# EAGLE schematic n64adv (EAGLE 9.5.1)

## Sheet 1 of 2
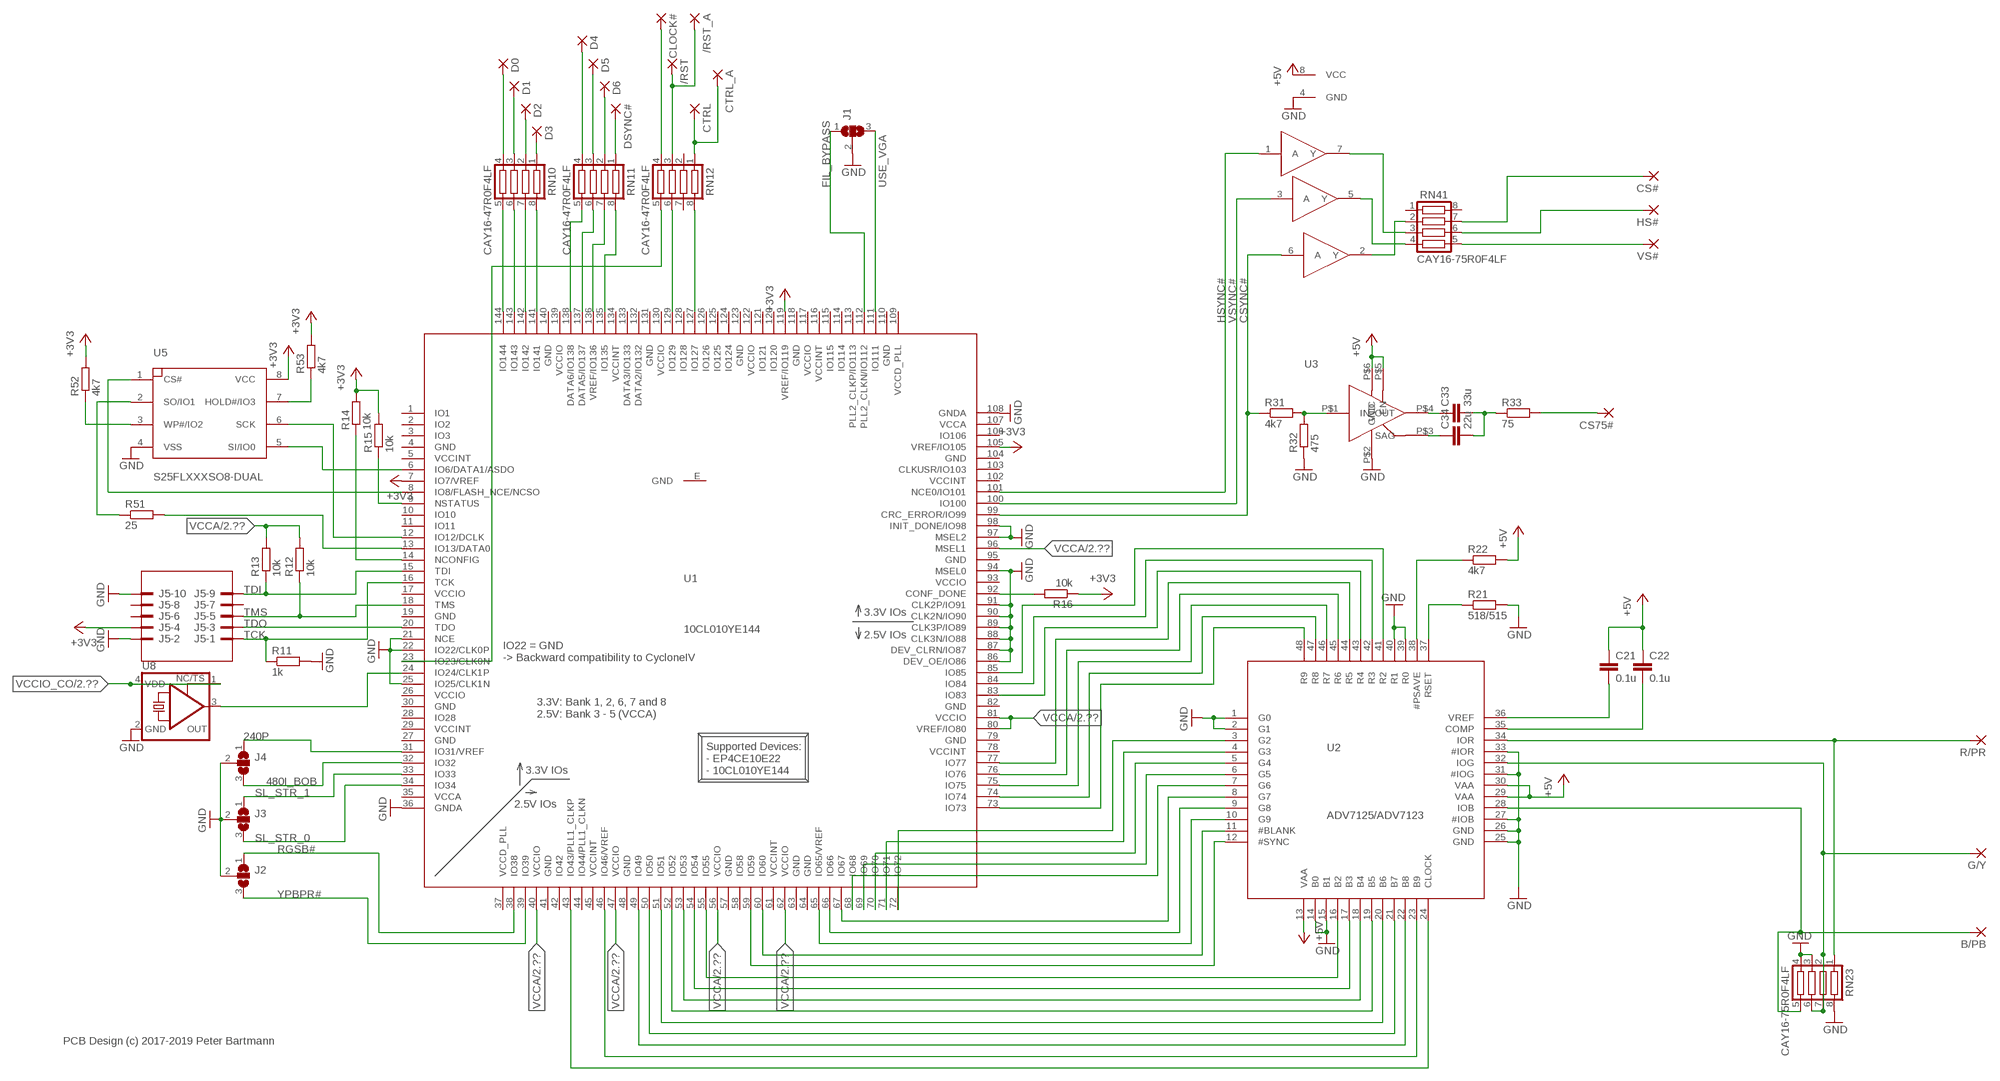
[diagram p0: schematic, sheet 1]

### Parts
/RST  SMD2  [SMD1,27-2,54]
/RST_A  SMD1  [SMD0,8-1,6]
B/PB  SMD2  [SMD1,27-2,54]
C21  0.1u  C-EUC0603  [C0603]
C22  0.1u  C-EUC0603  [C0603]
C33  33u  C-EUC1210  [C1210]
C34  22u  C-EUC1206  [C1206]
CLOCK#  SMD1  [SMD0,8-1,6]
CS75#  SMD2  [SMD1,27-2,54]
CS#  SMD2  [SMD1,27-2,54]
CTRL  SMD2  [SMD1,27-2,54]
CTRL_A  SMD1  [SMD0,8-1,6]
D0  SMD1  [SMD0,8-1,6]
D1  SMD1  [SMD0,8-1,6]
D2  SMD1  [SMD0,8-1,6]
D3  SMD1  [SMD0,8-1,6]
D4  SMD1  [SMD0,8-1,6]
D5  SMD1  [SMD0,8-1,6]
D6  SMD1  [SMD0,8-1,6]
DSYNC#  SMD1  [SMD0,8-1,6]
G/Y  SMD2  [SMD1,27-2,54]
HS#  SMD2  [SMD1,27-2,54]
J1  SJ2W  [SJ_2]
J2  SJ2W  [SJ_2]
J3  SJ2W  [SJ_2]
J4  SJ2W  [SJ_2]
J5  2510-  [PAK100/2500-10]
R11  1k  R-EU_R0603  [R0603]
R12  10k  R-EU_R0603  [R0603]
R13  10k  R-EU_R0603  [R0603]
R14  10k  R-EU_R0603  [R0603]
R15  10k  R-EU_R0603  [R0603]
R16  10k  R-EU_R0603  [R0603]
R21  518/515  R-EU_R0603  [R0603]
R22  4k7  R-EU_R0603  [R0603]
R31  4k7  R-EU_R0603  [R0603]
R32  475  R-EU_R0603  [R0603]
R33  75  R-EU_R0603  [R0603]
R51  25  R-EU_R0603  [R0603]
R52  4k7  R-EU_R0603  [R0603]
R53  4k7  R-EU_R0603  [R0603]
R/PR  SMD2  [SMD1,27-2,54]
RN10  CAY16-47R0F4LF  CTS742C083  [CTS742C083]
RN11  CAY16-47R0F4LF  CTS742C083  [CTS742C083]
RN12  CAY16-47R0F4LF  CTS742C083  [CTS742C083]
RN23  CAY16-75R0F4LF  CTS742C083  [CTS742C083]
RN41  CAY16-75R0F4LF  CTS742C083  [CTS742C083]
U1  10CL010YE144  [EQFP144_2]
U2  ADV7125/ADV7123  ADV7123  [LQFP48]
U3  TSH122ICT  [SC70]
U4  74LVC3G17  74LVC3G34  [74LVC3G34]
U5  S25FLXXXSO8-DUAL  [SO8-DUAL]
U8  KXO-PXO/XO-V96  [3.2X2.5_KXO-V96]
VS#  SMD2  [SMD1,27-2,54]

### Nets
240P: J4.1 U1.31(IO31/VREF)
480I_BOB: J4.3 U1.32(IO32)
+5V: C21.1 C22.1 R22.2 U2.13(VAA) U2.29(VAA) U2.30(VAA) U3.P$5(EN) U3.P$6(VCC) U4.8(VCC) ; also sheet 2
BLUE: B/PB.1(P) RN23.5 U2.28(IOB)
CSYNC47#: CS#.1(P) RN41.7
CSYNC#: R31.1 U1.99(CRC_ERROR/IO99) U4.6(A)
FIL_BYPASS: J1.1 U1.112(PLL2_CLKN/IO112)
GND: J1.2 J2.2 J3.2 J4.2 J5.2 J5.10 R11.2 R21.2 R32.1 RN23.3 RN23.4 RN23.8 U1.21(NCE) U1.22(IO22/CLK0P) U1.25(IO25/CLK1N) U1.36(GNDA) U1.86(DEV_OE/IO86) U1.87(DEV_CLRN/IO87) U1.88(CLK3N/IO88) U1.89(CLK3P/IO89) U1.90(CLK2N/IO90) U1.91(CLK2P/IO91) U1.94(MSEL0) U1.97(MSEL2) U1.98(INIT_DONE/IO98) U1.108(GNDA) U2.1(G0) U2.2(G1) U2.14(B0) U2.15(B1) U2.25(GND) U2.26(GND) U2.27(#IOB) U2.31(#IOG) U2.33(#IOR) U2.39(R0) U2.40(R1) U3.P$2(GND) U4.4(GND) U5.4(VSS) U8.2(GND) ; also sheet 2
GREEN: G/Y.1(P) RN23.2 RN23.6 RN23.7 U2.32(IOG)
HSYNC47#: HS#.1(P) RN41.6
HSYNC#: U1.101(NCE0/IO101) U4.1(A)
N$1: R31.2 R32.2 U3.P$1(IN)
N$2: R21.1 U2.37(RSET)
N$3: RN12.5 U1.23(IO23/CLK0N)
N$4: U1.43(IO43/PLL1_CLKP) U2.24(CLOCK)
N$5: U1.46(IO46/VREF) U2.23(B9)
N$6: U1.49(IO49) U2.22(B8)
N$7: U1.50(IO50) U2.21(B7)
N$8: R14.1 U1.14(NCONFIG)
N$9: U1.51(IO51) U2.20(B6)
N$10: U1.52(IO52) U2.19(B5)
N$11: U1.53(IO53) U2.18(B4)
N$12: U1.54(IO54) U2.17(B3)
N$13: U1.55(IO55) U2.16(B2)
N$14: U1.72(IO72) U2.3(G2)
N$15: C33.1 U3.P$4(OUT)
N$16: C34.1 U3.P$3(SAG)
N$17: C33.2 C34.2 R33.1
N$18: U1.71(IO71) U2.4(G3)
N$19: U1.70(IO70) U2.5(G4)
N$20: U1.69(IO69) U2.6(G5)
N$21: CS75#.1(P) R33.2
N$22: R22.1 U2.38(#PSAVE)
N$23: C22.2 U2.35(COMP)
N$24: C21.2 U2.36(VREF)
N$26: RN41.2 U4.2(Y)
N$27: U1.68(IO68) U2.7(G6)
N$28: U1.67(IO67) U2.8(G7)
N$29: U1.66(IO66) U2.9(G8)
N$30: U1.65(IO65/VREF) U2.10(G9)
N$31: U1.60(IO60) U2.11(#BLANK)
N$32: U1.59(IO59) U2.12(#SYNC)
N$33: U1.85(IO85) U2.41(R2)
N$34: U1.84(IO84) U2.42(R3)
N$35: U1.83(IO83) U2.43(R4)
N$36: U1.77(IO77) U2.44(R5)
N$37: U1.76(IO76) U2.45(R6)
N$38: U1.75(IO75) U2.46(R7)
N$39: U1.74(IO74) U2.47(R8)
N$40: U1.73(IO73) U2.48(R9)
N$41: RN10.5 U1.144(IO144)
N$42: RN10.6 U1.143(IO143)
N$43: RN10.7 U1.142(IO142)
N$44: RN10.8 U1.141(IO141)
N$45: R15.1 U1.9(NSTATUS)
N$46: RN11.5 U1.138(DATA6/IO138)
N$47: RN41.4 U4.5(Y)
N$49: RN11.6 U1.137(DATA5/IO137)
N$50: RN11.7 U1.136(VREF/IO136)
N$51: RN11.8 U1.135(IO135)
N$52: R16.2 U1.92(CONF_DONE)
N$53: D0.P$1(P) RN10.4
N$55: RN12.6 U1.129(IO129)
N$56: R53.1 U5.7(HOLD#/IO3)
N$57: RN12.8 U1.127(IO127)
N$58: D1.P$1(P) RN10.3
N$59: D2.P$1(P) RN10.2
N$60: D3.P$1(P) RN10.1
N$61: D4.P$1(P) RN11.4
N$62: D5.P$1(P) RN11.3
N$63: D6.P$1(P) RN11.2
N$64: DSYNC#.P$1(P) RN11.1
N$65: CLOCK#.P$1(P) RN12.4
N$66: CTRL.1(P) CTRL_A.P$1(P) RN12.1
N$67: R52.1 U5.3(WP#/IO2)
N$68: RN41.3 U4.7(Y)
N$69: R51.1 U5.2(SO/IO1)
N$70: /RST.1(P) /RST_A.P$1(P) RN12.3
N$72: R51.2 U1.13(IO13/DATA0)
N$73: U1.12(IO12/DCLK) U5.6(SCK)
N$75: U1.8(IO8/FLASH_NCE/NCSO) U5.1(CS#)
N$76: U1.6(IO6/DATA1/ASDO) U5.5(SI/IO0)
N$77: U1.24(IO24/CLK1P) U8.3(OUT)
RED: R/PR.1(P) RN23.1 U2.34(IOR)
RGSB#: J2.1 U1.38(IO38)
SL_STR_0: J3.3 U1.34(IO34)
SL_STR_1: J3.1 U1.33(IO33)
TCK: J5.1 R11.1 U1.16(TCK)
TDI: J5.9 R13.1 U1.15(TDI)
TDO: J5.3 U1.20(TDO)
TMS: J5.5 R12.1 U1.18(TMS)
USE_VGA: J1.3 U1.111(IO111)
VCCA: R12.2 R13.2 U1.40(VCCIO) U1.47(VCCIO) U1.56(VCCIO) U1.62(VCCIO) U1.80(VREF/IO80) U1.81(VCCIO) U1.96(MSEL1) ; also sheet 2
VCCIO: J5.4 R14.2 R15.2 R16.1 R52.2 R53.2 U1.7(IO7/VREF) U1.105(VREF/IO105) U1.119(VREF/IO119) U5.8(VCC) ; supply symbol labelled +3V3 ; also sheet 2
VCCIO_CO: U8.1(TS) U8.4(VDD) ; also sheet 2
VSYNC47#: RN41.5 VS#.1(P)
VSYNC#: U1.100(IO100) U4.3(A)
YPBPR#: J2.3 U1.39(IO39)
Unconnected: J5.6 J5.7 J5.8 RN12.2 RN12.7 RN41.1 RN41.8 U1.1(IO1) U1.2(IO2) U1.3(IO3) U1.10(IO10) U1.11(IO11) U1.28(IO28) U1.42(IO42) U1.44(IO44/PLL1_CLKN) U1.58(IO58) U1.103(CLKUSR/IO103) U1.106(IO106) U1.113(PLL2_CLKP/IO113) U1.114(IO114) U1.115(IO115) U1.120(IO120) U1.121(IO121) U1.124(IO124) U1.125(IO125) U1.126(IO126) U1.128(IO128) U1.132(DATA2/IO132) U1.133(DATA3/IO133)

### Notes on the sheet
- 3.3V IOs
- 2.5V IOs
- IO22 = GND
  -> Backward compatibility to CycloneIV
- 3.3V: Bank 1, 2, 6, 7 and 8
  2.5V: Bank 3 - 5 (VCCA)
- 3.3V IOs
- Supported Devices:
  - EP4CE10E22
  - 10CL010YE144
- 2.5V IOs
- PCB Design (c) 2017-2019 Peter Bartmann

## Sheet 2 of 2
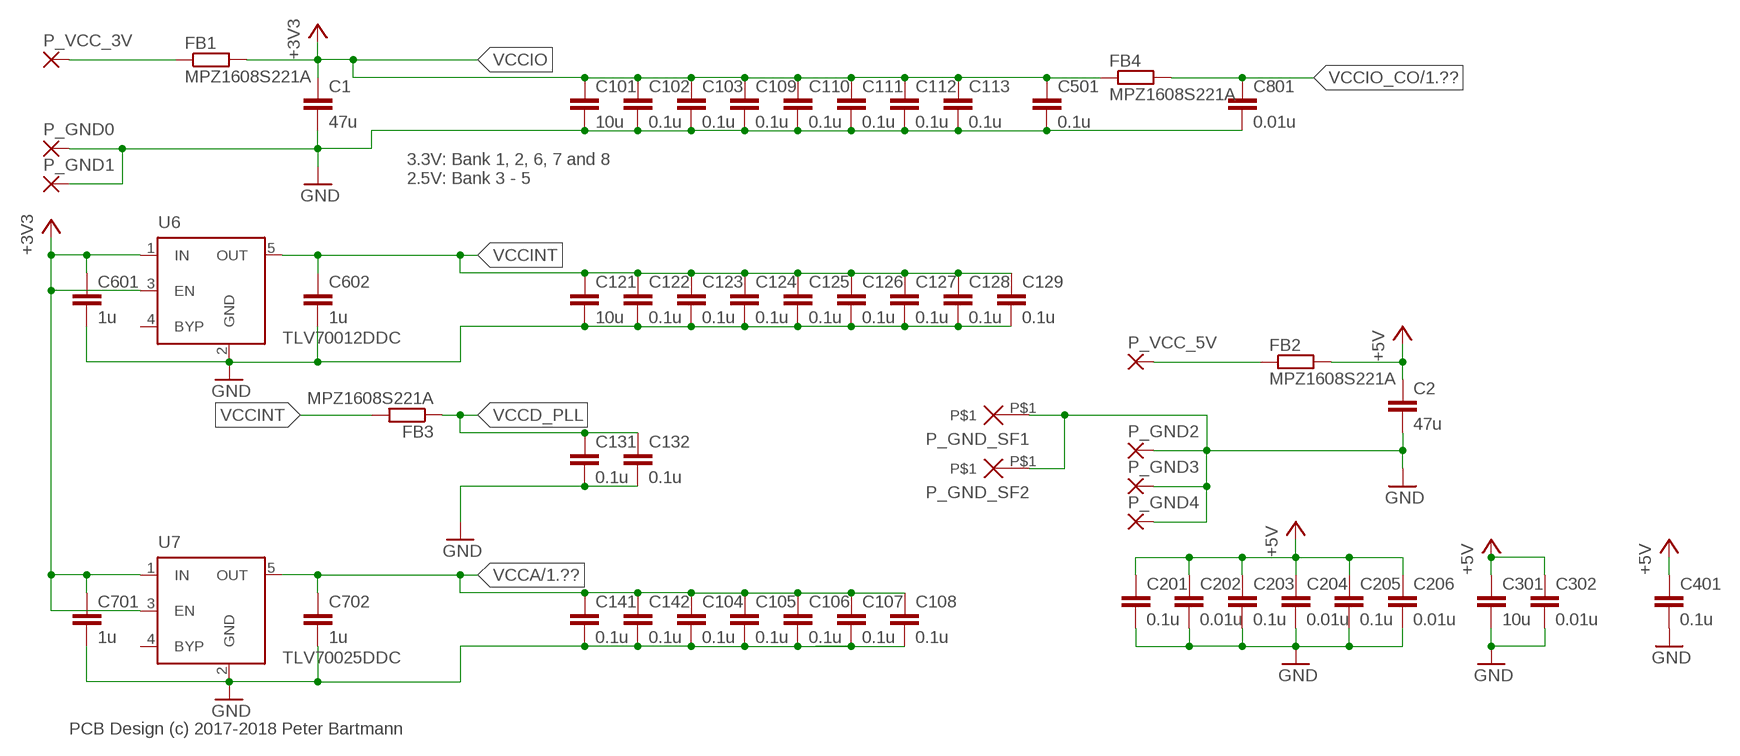
[diagram p1: schematic, sheet 2]

### Parts
C1  47u  C-EUC0805  [C0805]
C2  47u  C-EUC0805  [C0805]
C101  10u  C-EUC0805  [C0805]
C102  0.1u  C-EUC0603  [C0603]
C103  0.1u  C-EUC0603  [C0603]
C104  0.1u  C-EUC0603  [C0603]
C105  0.1u  C-EUC0603  [C0603]
C106  0.1u  C-EUC0603  [C0603]
C107  0.1u  C-EUC0603  [C0603]
C108  0.1u  C-EUC0603  [C0603]
C109  0.1u  C-EUC0603  [C0603]
C110  0.1u  C-EUC0603  [C0603]
C111  0.1u  C-EUC0603  [C0603]
C112  0.1u  C-EUC0603  [C0603]
C113  0.1u  C-EUC0603  [C0603]
C121  10u  C-EUC0805  [C0805]
C122  0.1u  C-EUC0603  [C0603]
C123  0.1u  C-EUC0603  [C0603]
C124  0.1u  C-EUC0603  [C0603]
C125  0.1u  C-EUC0603  [C0603]
C126  0.1u  C-EUC0603  [C0603]
C127  0.1u  C-EUC0603  [C0603]
C128  0.1u  C-EUC0603  [C0603]
C129  0.1u  C-EUC0603  [C0603]
C131  0.1u  C-EUC0603  [C0603]
C132  0.1u  C-EUC0603  [C0603]
C141  0.1u  C-EUC0603  [C0603]
C142  0.1u  C-EUC0603  [C0603]
C201  0.1u  C-EUC0603  [C0603]
C202  0.01u  C-EUC0603  [C0603]
C203  0.1u  C-EUC0603  [C0603]
C204  0.01u  C-EUC0603  [C0603]
C205  0.1u  C-EUC0603  [C0603]
C206  0.01u  C-EUC0603  [C0603]
C301  10u  C-EUC0805  [C0805]
C302  0.01u  C-EUC0603  [C0603]
C401  0.1u  C-EUC0603  [C0603]
C501  0.1u  C-EUC0603  [C0603]
C601  1u  C-EUC0603  [C0603]
C602  1u  C-EUC0603  [C0603]
C701  1u  C-EUC0603  [C0603]
C702  1u  C-EUC0603  [C0603]
C801  0.01u  C-EUC0603  [C0603]
FB1  MPZ1608S221A  R-EU_R0603  [R0603]
FB2  MPZ1608S221A  R-EU_R0603  [R0603]
FB3  MPZ1608S221A  R-EU_R0603  [R0603]
FB4  MPZ1608S221A  R-EU_R0603  [R0603]
P_GND0  SMD2  [SMD1,27-2,54]
P_GND1  SMD2  [SMD1,27-2,54]
P_GND2  SMD2  [SMD1,27-2,54]
P_GND3  SMD2  [SMD1,27-2,54]
P_GND4  SMD2  [SMD1,27-2,54]
P_GND_SF1  PADSHIELD_FINGER  [GND_FINGER_PAD]
P_GND_SF2  PADSHIELD_FINGER  [GND_FINGER_PAD]
P_VCC_3V  SMD2  [SMD1,27-2,54]
P_VCC_5V  SMD2  [SMD1,27-2,54]
U6  TLV70012DDC  MIC5219XX  [SOT23-5]
U7  TLV70025DDC  MIC5219XX  [SOT23-5]

### Nets
+5V: C2.1 C201.1 C202.1 C203.1 C204.1 C205.1 C206.1 C301.1 C302.1 C401.1 FB2.2 ; also sheet 1
GND: C1.2 C2.2 C101.2 C102.2 C103.2 C104.2 C105.2 C106.2 C107.2 C108.2 C109.2 C110.2 C111.2 C112.2 C113.2 C121.2 C122.2 C123.2 C124.2 C125.2 C126.2 C127.2 C128.2 C129.2 C131.2 C132.2 C141.2 C142.2 C201.2 C202.2 C203.2 C204.2 C205.2 C206.2 C301.2 C302.2 C401.2 C501.2 C601.2 C602.2 C701.2 C702.2 C801.2 P_GND0.1(P) P_GND1.1(P) P_GND2.1(P) P_GND3.1(P) P_GND4.1(P) P_GND_SF1.P$1 P_GND_SF2.P$1 U6.2(GND) U7.2(GND) ; also sheet 1
N$48: FB2.1 P_VCC_5V.1(P)
N$54: FB1.1 P_VCC_3V.1(P)
VCCA: C104.1 C105.1 C106.1 C107.1 C108.1 C141.1 C142.1 C702.1 U7.5(OUT) ; also sheet 1
VCCD_PLL: C131.1 C132.1 FB3.1
VCCINT: C121.1 C122.1 C123.1 C124.1 C125.1 C126.1 C127.1 C128.1 C129.1 C602.1 FB3.2 U6.5(OUT)
VCCIO: C1.1 C101.1 C102.1 C103.1 C109.1 C110.1 C111.1 C112.1 C113.1 C501.1 C601.1 C701.1 FB1.2 FB4.1 U6.1(IN) U6.3(EN) U7.1(IN) U7.3(EN) ; supply symbol labelled +3V3 ; also sheet 1
VCCIO_CO: C801.1 FB4.2 ; also sheet 1
Unconnected: U6.4(BYP) U7.4(BYP)

### Notes on the sheet
- 3.3V: Bank 1, 2, 6, 7 and 8
  2.5V: Bank 3 - 5
- PCB Design (c) 2017-2018 Peter Bartmann

## Power pins joined to a net without a drawn wire
GND: U1.4(GND) U1.19(GND) U1.27(GND) U1.30(GND) U1.41(GND) U1.48(GND) U1.57(GND) U1.63(GND) U1.64(GND) U1.79(GND) U1.82(GND) U1.95(GND) U1.104(GND) U1.110(GND) U1.118(GND) U1.123(GND) U1.131(GND) U1.140(GND) U1.E(GND)
VCCA: U1.35(VCCA) U1.107(VCCA)
VCCD_PLL: U1.37(VCCD_PLL) U1.109(VCCD_PLL)
VCCINT: U1.5(VCCINT) U1.29(VCCINT) U1.45(VCCINT) U1.61(VCCINT) U1.78(VCCINT) U1.102(VCCINT) U1.116(VCCINT) U1.134(VCCINT)
VCCIO: U1.17(VCCIO) U1.26(VCCIO) U1.93(VCCIO) U1.117(VCCIO) U1.122(VCCIO) U1.130(VCCIO) U1.139(VCCIO)

## Library data of the parts
/RST B/PB CS75# CS# CTRL G/Y HS# P_GND0 P_GND1-P_GND4 P_VCC_3V P_VCC_5V R/PR VS# = wirepad@1:SMD2: SMD PAD
/RST_A CLOCK# CTRL_A D0 D1-D6 DSYNC# = wirepad:SMD1
C1 C2 C21 C22 C34 C101-C113 C121-C129 C131 C132 C141 C142 C201-C206 C301 C302 C401 C501 C601 C602 C701 C702 C801 = rcl:C-EU: CAPACITOR, European symbol
C33 = rcl@1:C-EU: CAPACITOR, European symbol
FB1-FB4 R11-R16 R21 R22 R31-R33 R51-R53 = rcl:R-EU_: RESISTOR, European symbol
J1-J4 = jumper:SJ2W: SMD solder JUMPER
J5 = con-3m:2510-: 3M (TM) Pak 100 4-Wall Header Source: 3M; MF: 3M; MPN: 2510-6002UB; OC_FARNELL: 9838244; OC_NEWARK: 46F4725
P_GND_SF1 P_GND_SF2 = snes_div:PAD
RN10-RN12 RN23 RN41 = resistor-net:CTS742C083: Chip Resistor Array 4 Single Resistor Source: http://www.ctscorp.com/components/Datasheets/CTSChipArrayDs.pdf; OC_FARNELL: unknown; OC_NEWARK: unknown
U1 = altera:10CL010
U2 = analog-devices:ADV7123
U3 = st-microelectronics:TSH122
U4 = OSSC_HDMI_Audio:74LVC3G34
U5 = cypress:S25FLXXX
U6 U7 = v-reg-micrel:MIC5219XX: VOLTAGE REGULATOR; OC_FARNELL: unknown; OC_NEWARK: unknown
U8 = crystal-geyer_V1_0:KXO-PXO/XO-V: Clock Oscillator (PXO/XO) MHz : KXO-V - Serie Model Size l/w/h [mm] Frequency Range Frequency Stability Temp. Range [°C] Output AECQ 200 availabel Datasheet KXO-V94 KXO-V94 KXO-V95 KXO-V95 KXO-V96 KXO-V96 KXO-V99 KXO-V99 KXO-97 KXO-V97 KXO-97 - KXO-V97 2.0/1.6/0.80 2.0/1.6/0.80 2.5/2.0/0.82 2.5/2.0/0.82 3.2/2.5/1.2 3.2/2.5/1.2 5.0/3.2/1.2 5.0/3.2/1.2 7.0/5.08/1.3 7.0/5.08/1.3 7.0/5.08/1.3 32,768 kHz 1,0 ~ 80,0 MHz 32,768 kHz 1,0 ~ 70,0 MHz 32,768 kHz 1,0 ~ 156,0 MHz 32,768 kHz 1,0 ~ 200,0 MHz 32,768 kHz 32,768 kHz 1,0 ~ 160,0 MHz ±25 … ±100ppm ±25 … ±100ppm ±25 … ±100ppm ±25 … ±100ppm ±25 … ±100ppm ±25 … ±100ppm ±25 … ±100ppm ±25 … ±100ppm ±25 … ±100ppm ±25 … ±100ppm ±25 … ±100ppm (*) -40°C …+85°C (*) -40°C …+85°C (*) -40°C …+85°C (*) -40°C …+85°C (*) -40°C …+85°C (*) -40°C …+85°C (*) -40°C …+85°C (*) -40°C …+85°C (*) -40°C …+85°C (*) -40°C …+85°C (*) -40°C …+85°C HCMOS HCMOS HCMOS HCMOS HCMOS HCMOS HCMOS HCMOS HCMOS HCMOS HCMOS - - yes yes yes yes - - - - - KXO-V94-kHz.pdf <http://www.geyer-electronic.de/uploads/tx_userartikelfrequenz/GEYER-KXO-V94-kHz.pdf> KXO-V94.pdf <http://www.geyer-electronic.de/uploads/tx_userartikelfrequenz/GEYER-KXO-V94.pdf> KXO-V95-kHz.pdf <http://www.geyer-electronic.de/uploads/tx_userartikelfrequenz/GEYER-KXO-V95-kHz.pdf> KXO-V95.pdf <http://www.geyer-electronic.de/uploads/tx_userartikelfrequenz/GEYER-KXO-V95.pdf> KXO-V96-kHz.pdf <http://www.geyer-electronic.de/uploads/tx_userartikelfrequenz/GEYER-KXO-V96-kHz.pdf> KXO-V96.pdf <http://www.geyer-electronic.de/uploads/tx_userartikelfrequenz/GEYER-KXO-V96.pdf> KXO-V99-kHz.pdf <http://www.geyer-electronic.de/uploads/tx_userartikelfrequenz/GEYER-KXO-V99-kHz.pdf> KXO-V99.pdf <http://www.geyer-electronic.de/uploads/tx_userartikelfrequenz/GEYER-KXO-V99.pdf> KXO-97-kHz.pdf <http://www.geyer-electronic.de/uploads/tx_userartikelfrequenz/GEYER-KXO-97-kHz.pdf> KXO-V97-kHz.pdf <http://www.geyer-electronic.de/uploads/tx_userartikelfrequenz/GEYER-KXO-V97-kHz.pdf> KXO-V97.pdf <http://www.geyer-electronic.de/uploads/tx_userartikelfrequenz/GEYER-KXO-V97.pdf> <http://www.geyer-electronic.de/fileadmin/template/img/logo-geyer-electronic.png> Details see: http://www.geyer-electronic.de/Frequenz-Produkte.9.0.html Created 2016-06-07, Hans Locher 2016 (C) Geyer Quartz Technology Hans Locher KXOV94,KXOV95;KXOV96;KXOV97;KXO97;2016;2520;3225;5032;70508;2,5x2,0;3,2x2,5;5,0x3,2;7,0x5,08;2.5x2.0;3.2x2.5;5.0x3.2;7.0x5.08;